# EAGLE design PCM1794_DAC_Test_V1_Power (EAGLE 6.4)

## Sheet 1 of 4: 3.3V Digital
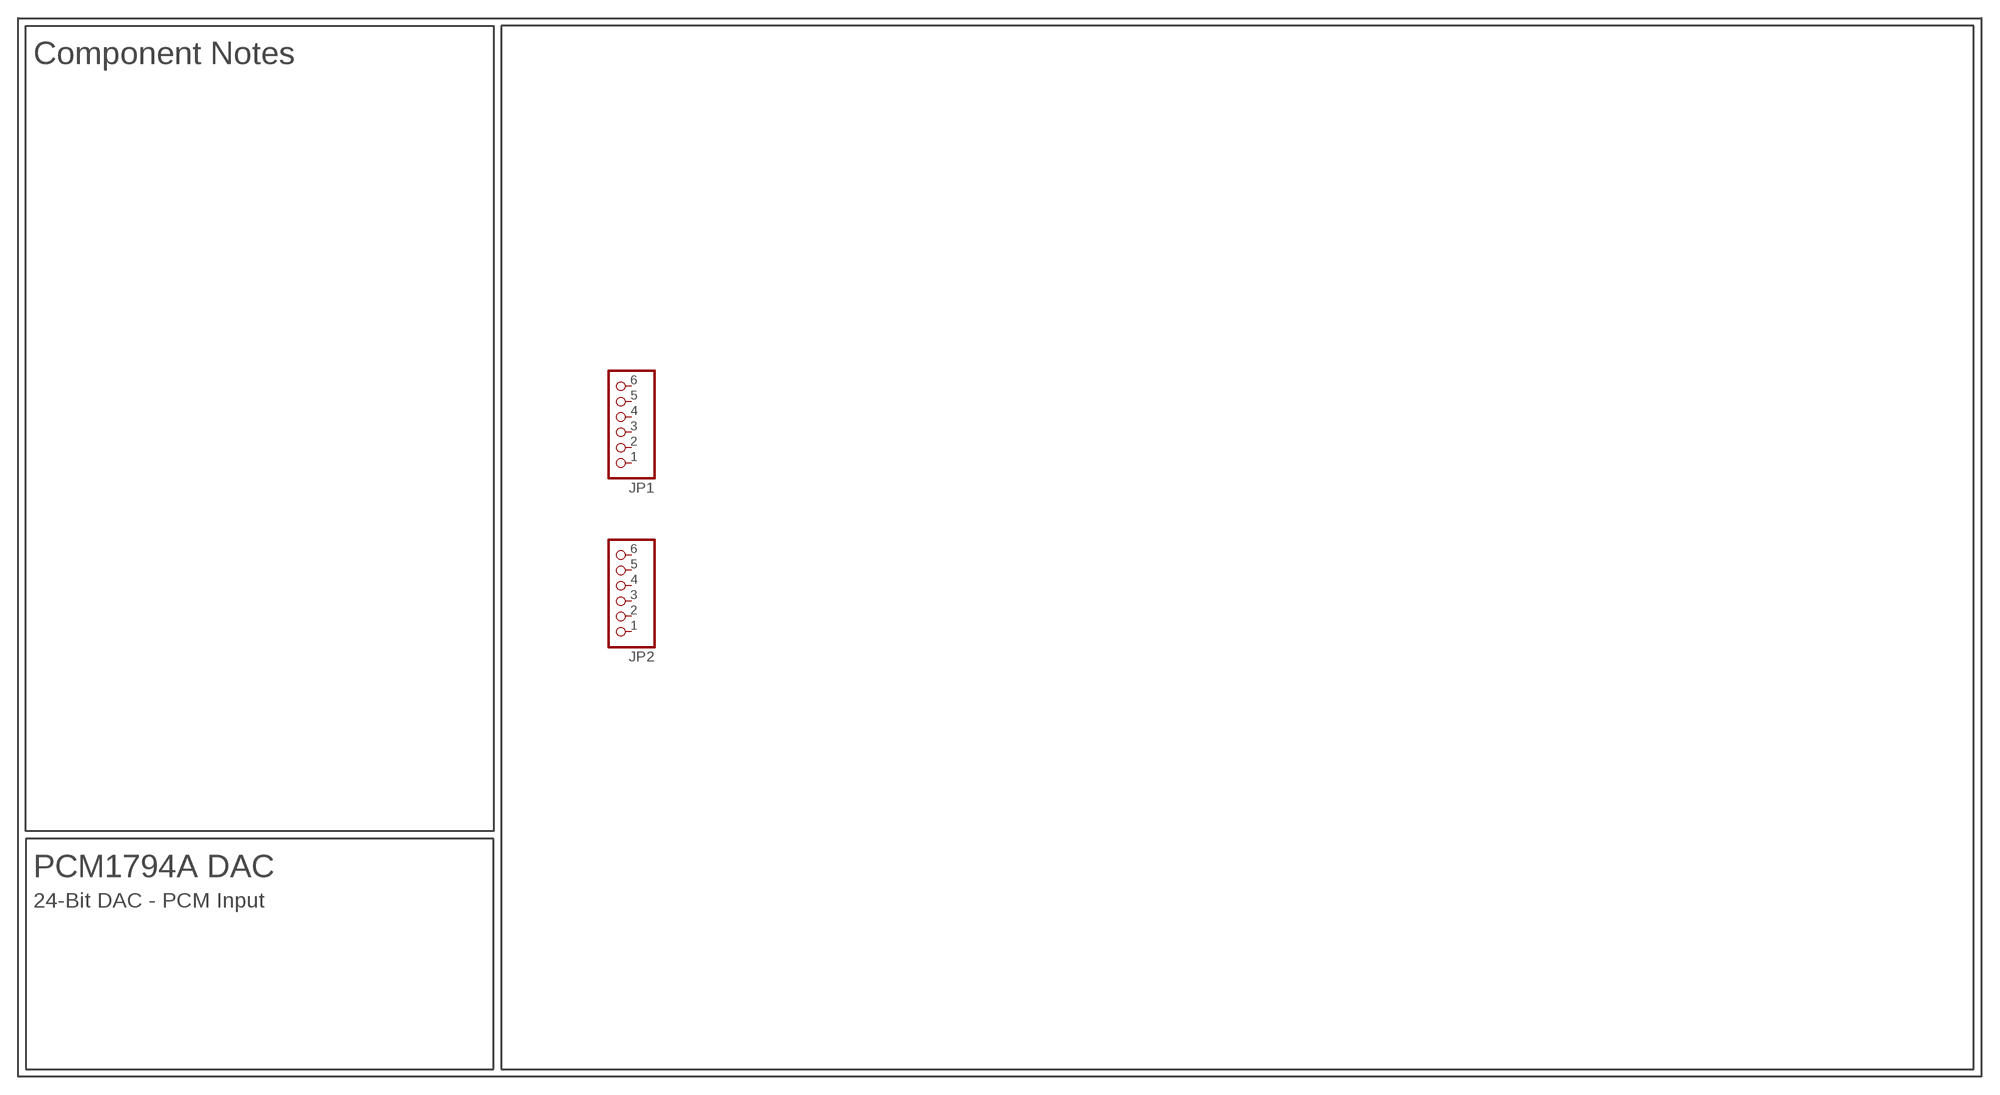
[diagram p0: schematic, sheet 1]

### Parts
JP1  PINHD-1X6  [1X06]
JP2  PINHD-1X6  [1X06]
Unconnected: JP1.1 JP1.2 JP1.3 JP1.4 JP1.5 JP1.6 JP2.1 JP2.2 JP2.3 JP2.4 JP2.5 JP2.6

### Notes on the sheet
- Component Notes
- PCM1794A DAC
- 24-Bit DAC - PCM Input

## Sheet 2 of 4: 5V Analog
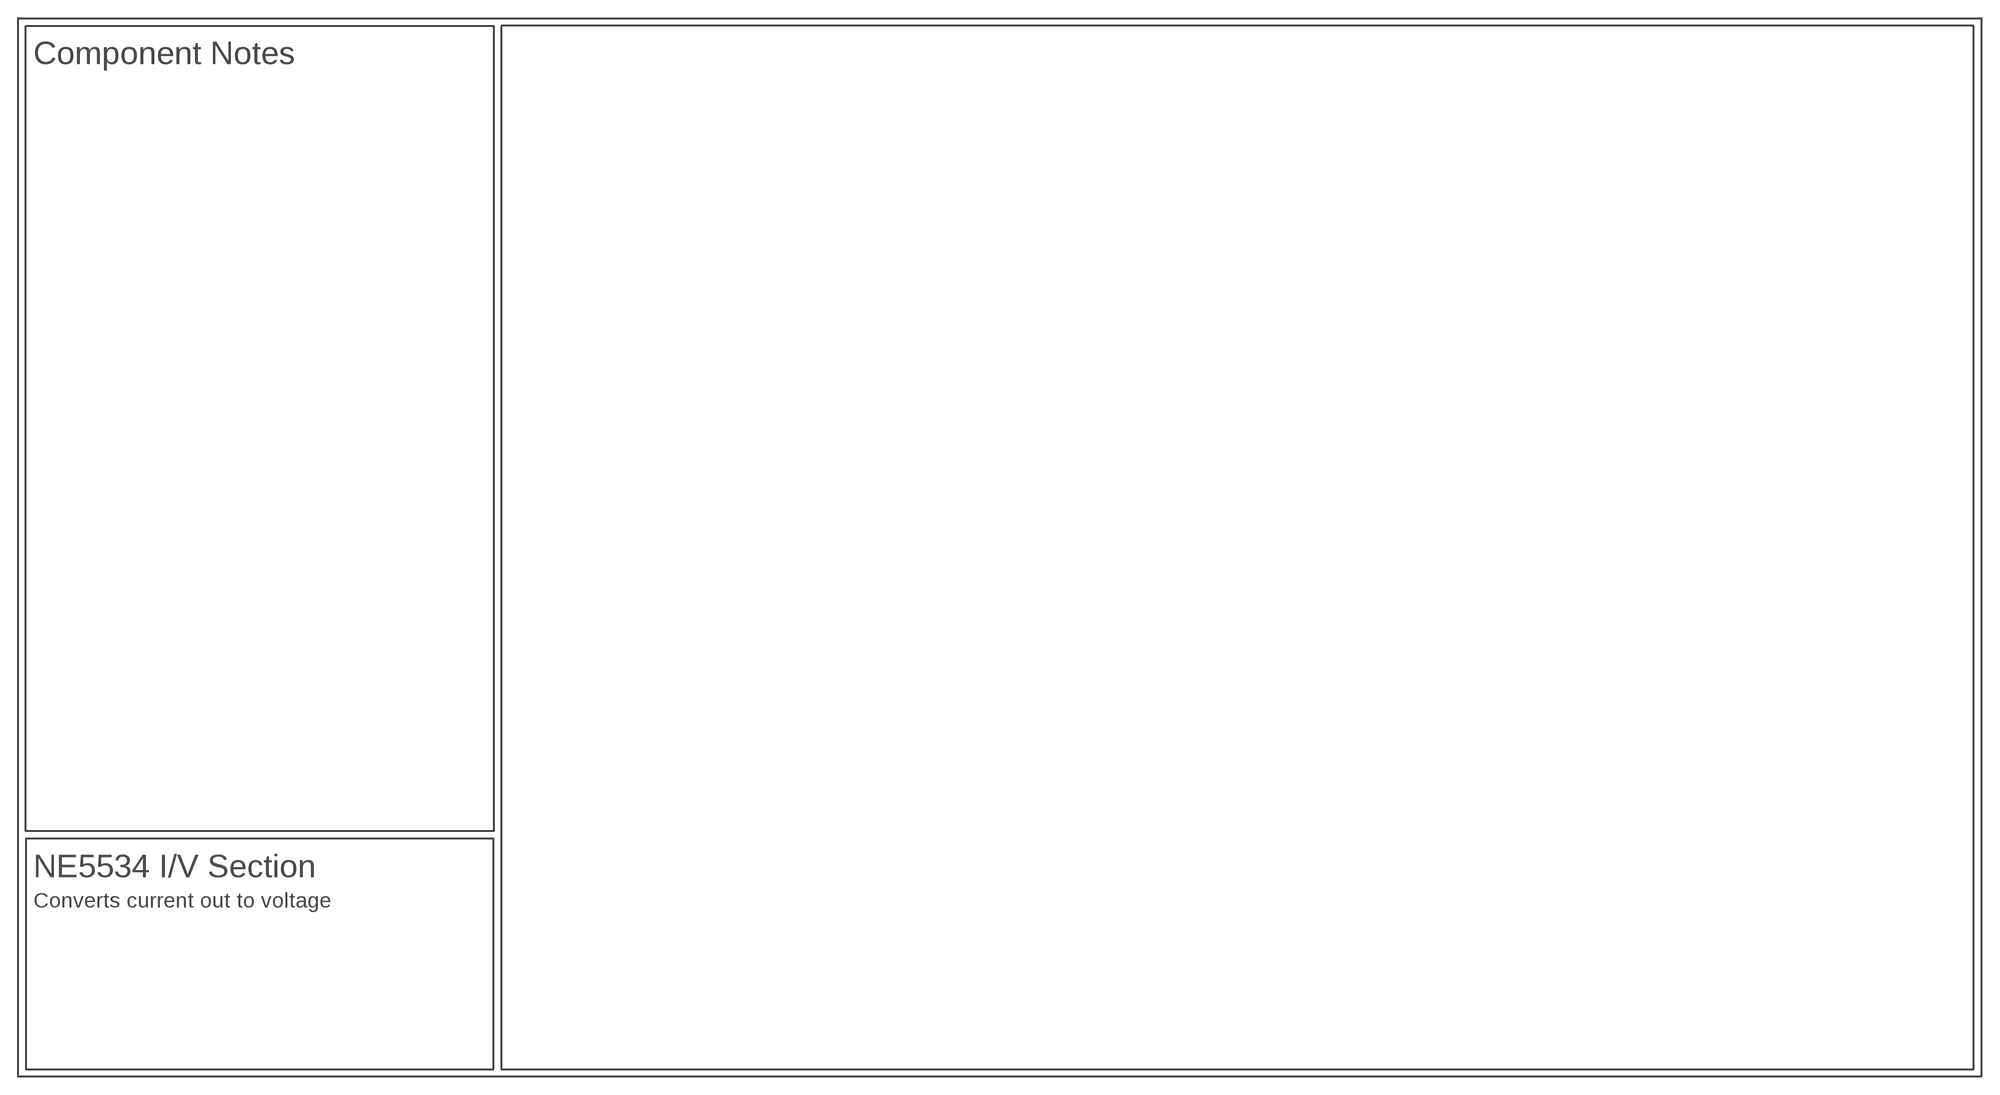
[diagram p1: schematic, sheet 2]

### Notes on the sheet
- Component Notes
- NE5534 I/V Section
- Converts current out to voltage

## Sheet 3 of 4: V+ Analog
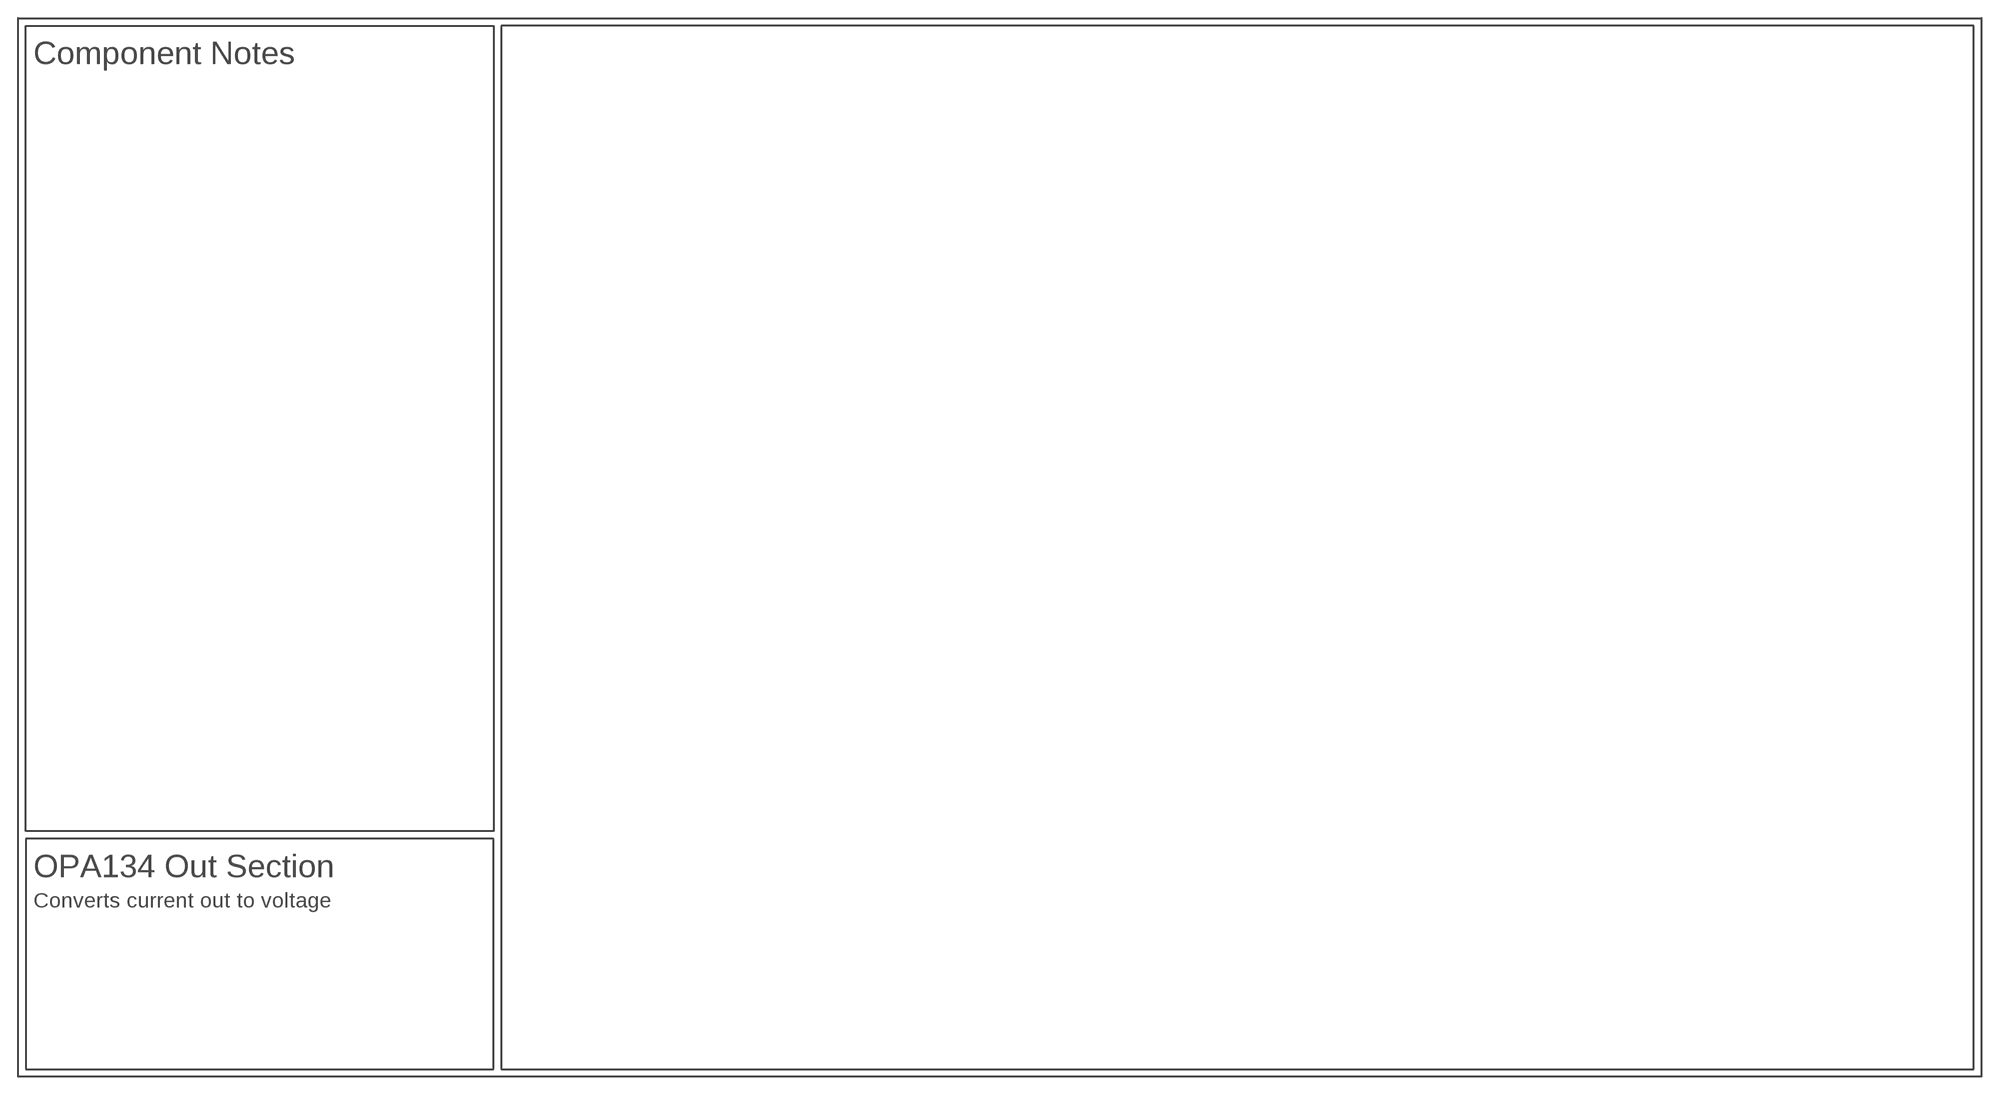
[diagram p2: schematic, sheet 3]

### Notes on the sheet
- Component Notes
- OPA134 Out Section
- Converts current out to voltage

## Sheet 4 of 4
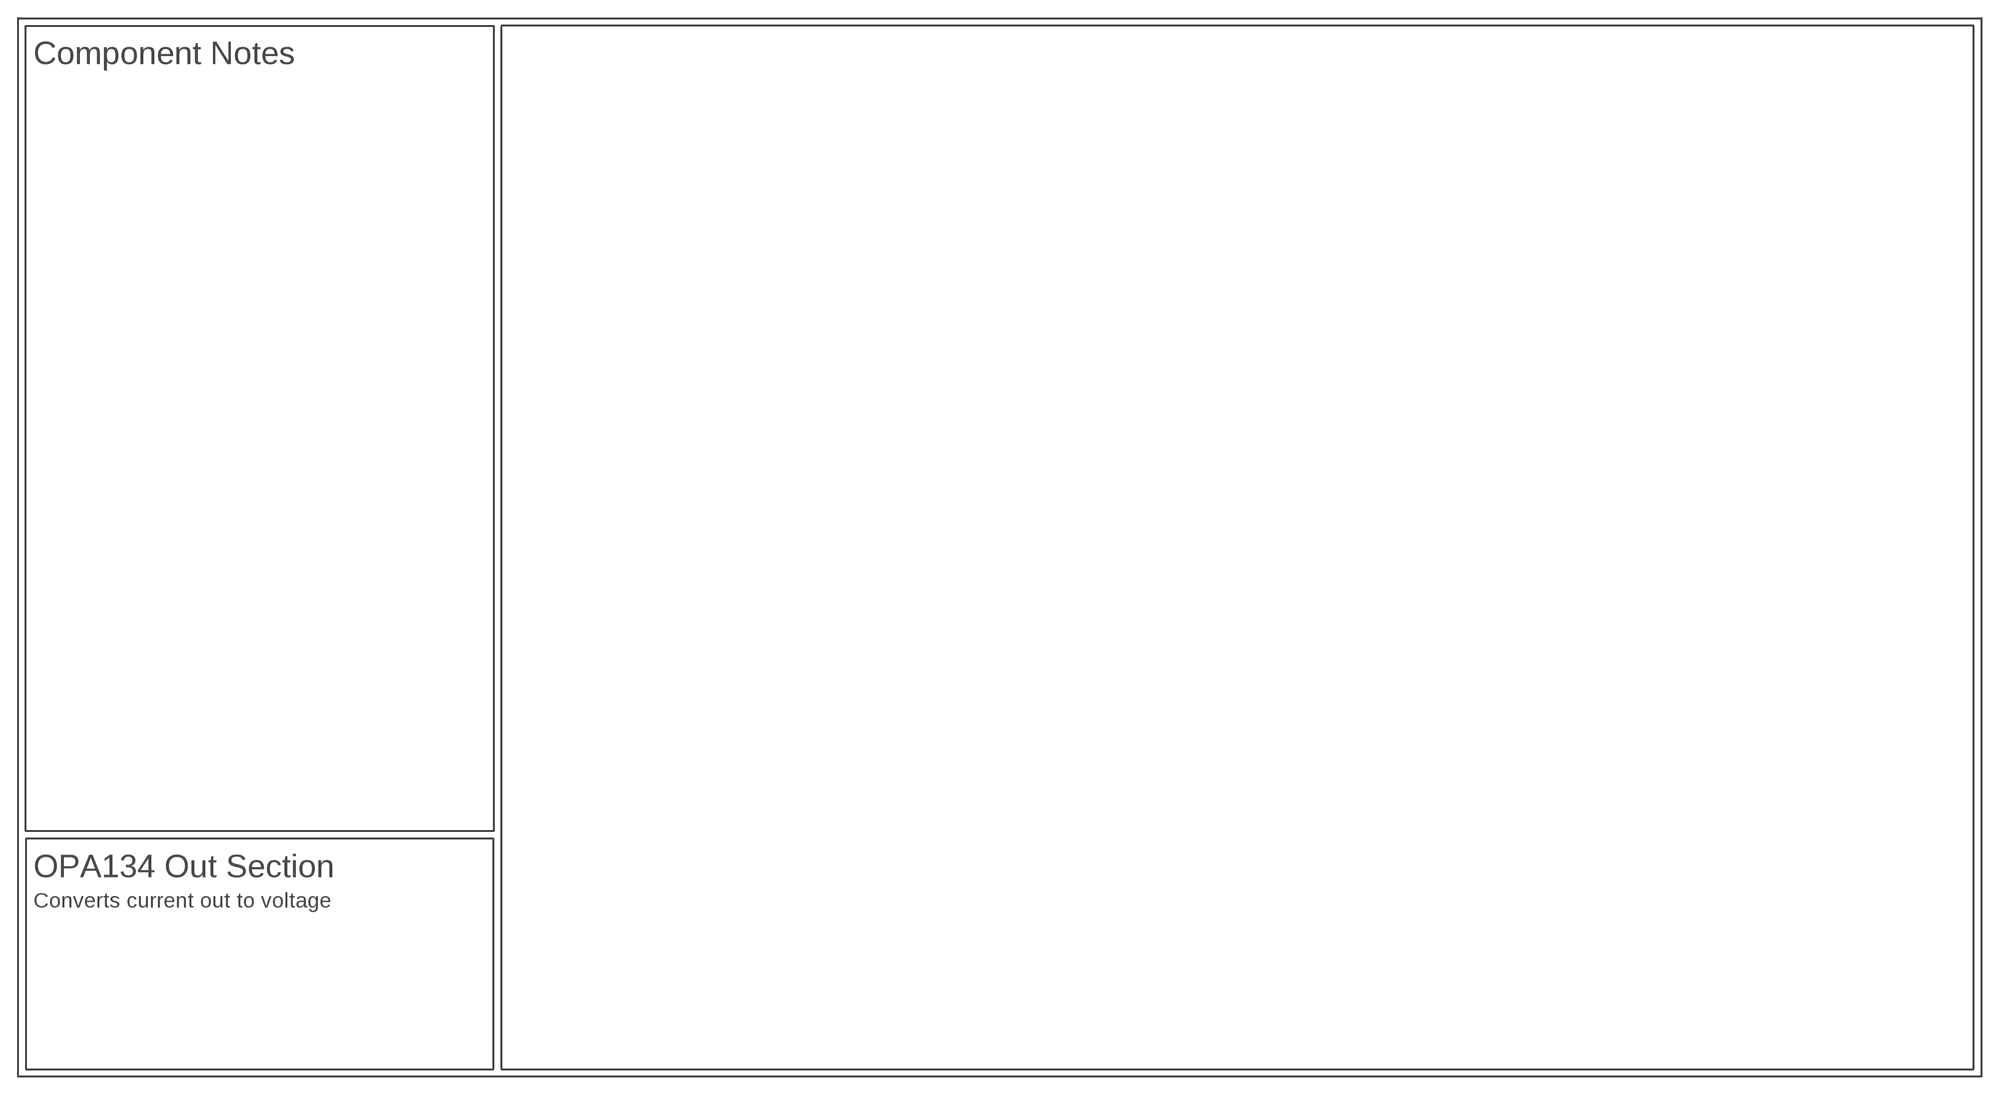
[diagram p3: schematic, sheet 4]

### Notes on the sheet
- Component Notes
- OPA134 Out Section
- Converts current out to voltage

## Library data of the parts
JP1 JP2 = pinhead_no_text:PINHD-1X6: PIN HEADER

## Board
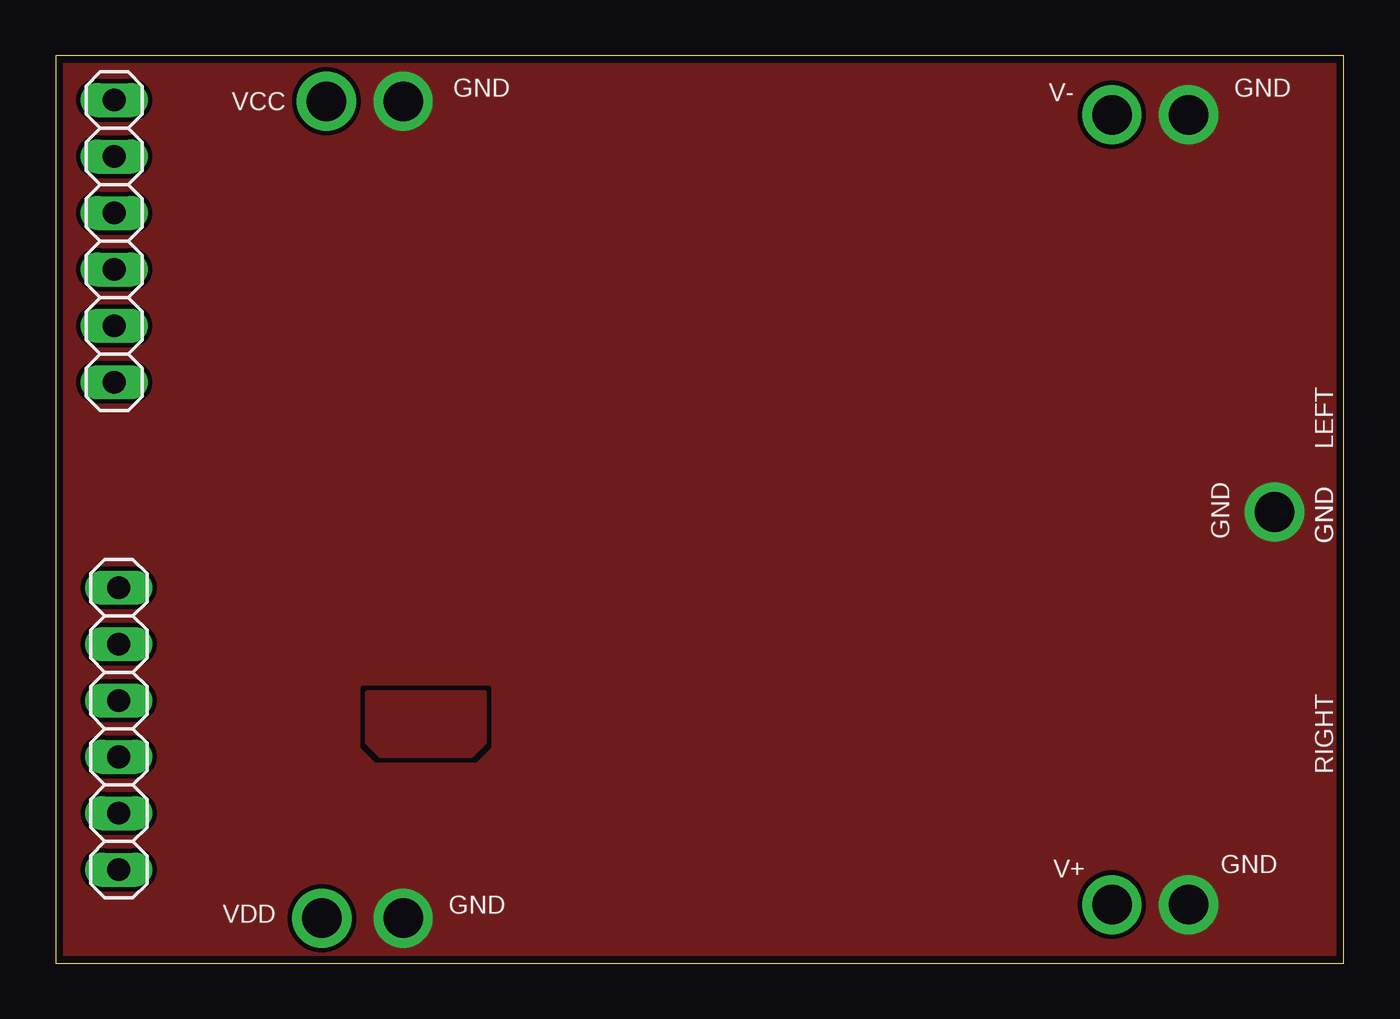
[diagram p4: board, top side]
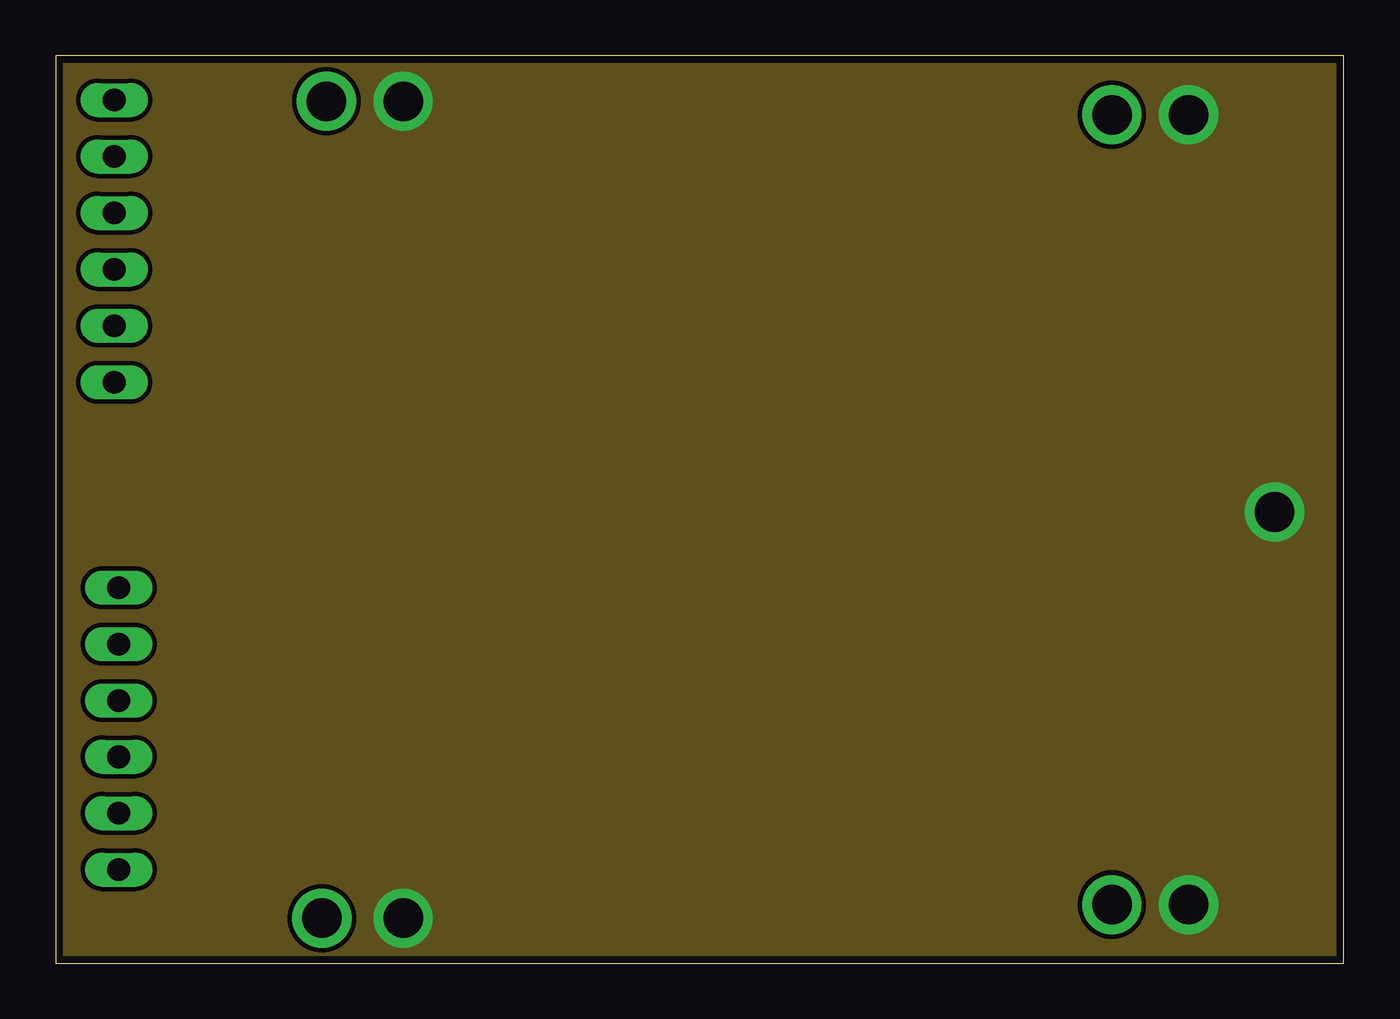
[diagram p5: board, inner layer Route2]
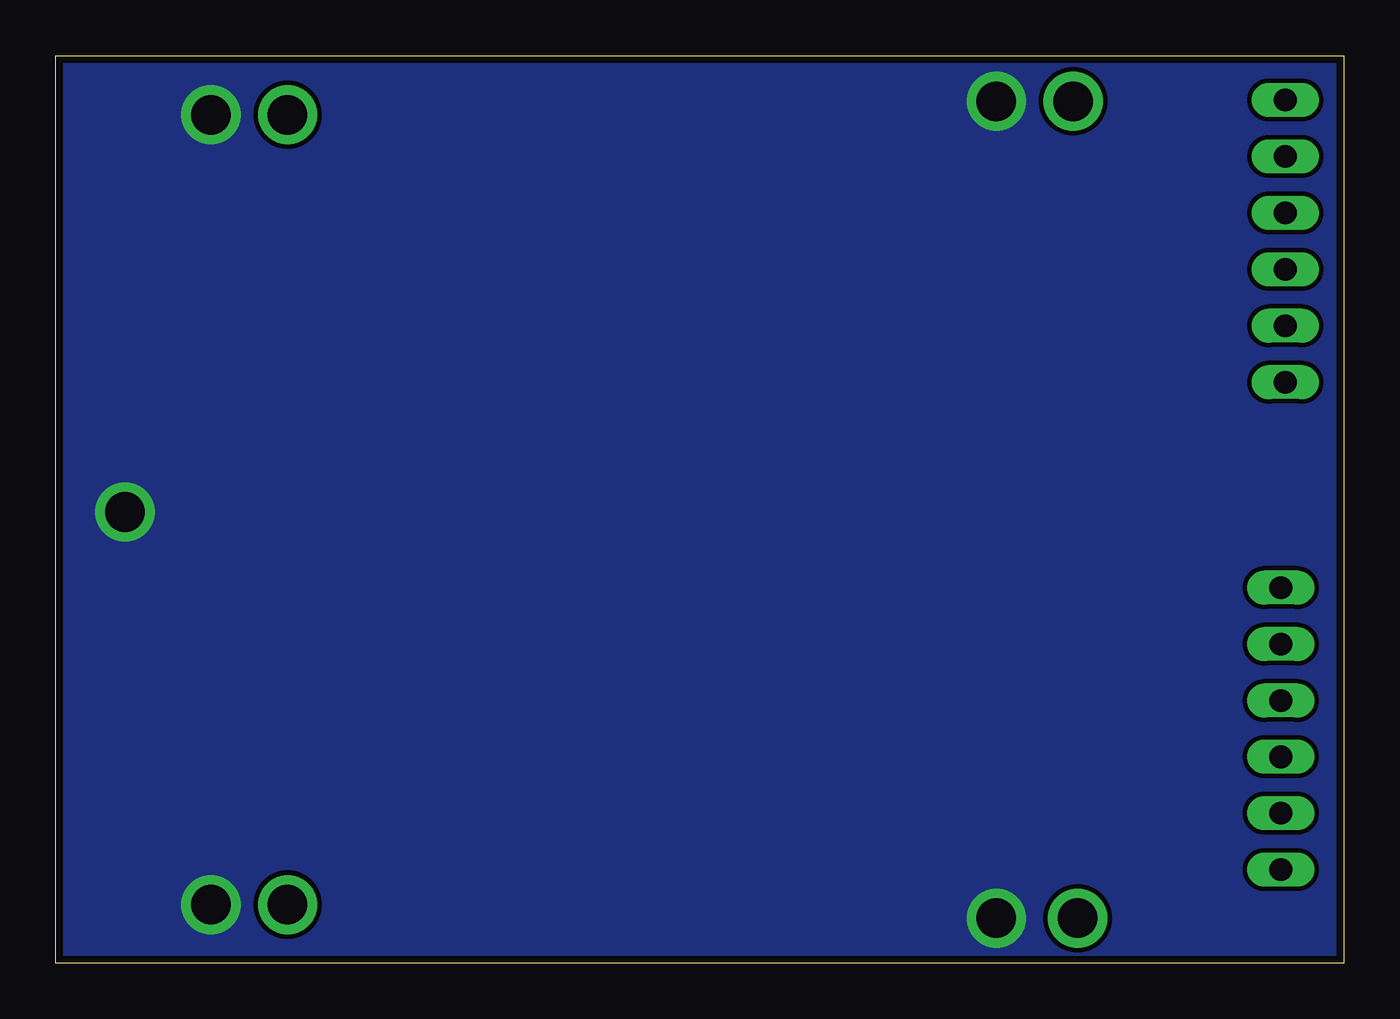
[diagram p6: board, bottom side, seen from below]

Size 57.99 x 40.87 mm. Coordinates in mm from the lower left corner, seen from the top.
Outline: 0,0 57.99,0 57.99,40.87 0,40.87 0,0
Copper layers (1*2*3*16): Top 0.035mm / dielectric 1.5mm / Route2 0.035mm / dielectric 0.15mm / Route3 0.035mm / dielectric 0.2mm / Bottom 0.035mm
Design rules "default *": minimum track width 5mil, minimum drill 10mil, track to track 8mil, track to pad 8mil, pad to pad 8mil, via to via 8mil, smd to smd 8mil, copper to edge 13mil, drill to drill 8mil, minimum pad ring 10mil, minimum via ring 8mil, stop-mask expansion 4mil, vias tented up to drill 0mil, thermal gap 10mil

### Footprints (pad centres in the part's own frame; a part is rotated, then mirrored left to right if it is on the bottom)
1X06 = drill 1.016 long: 1 -6.35,0; 2 -3.81,0; 3 -1.27,0; 4 1.27,0; 5 3.81,0; 6 6.35,0

### Placement (x,y rotation side)
JP1  2.84,10.57 270 top
JP2  2.64,32.51 270 top

### Tracks (layer width: path | path; a pad name or v marks a point on that pad's centre or on a via)
GND  (via drill 1.78)
  other vias: 54.86,20.32 15.65,38.81 15.65,2.03 51,2.64 51,38.2
  pour Bottom (rank 6, no thermals): 0.2,40.64 57.71,40.64 57.71,0.2 0.2,0.2
  pour Top (rank 6, no thermals): 0.2,40.64 57.71,40.64 57.71,0.2 0.2,0.2
  pour Route2 (rank 6, no thermals): 0.2,40.64 57.71,40.64 57.71,0.2 0.2,0.2
N$1  (via drill 1.78)
  other vias: 11.99,2.03
V+  (via drill 1.78)
  other vias: 47.55,2.64
V-  (via drill 1.78)
  other vias: 47.55,38.2
VCC  (via drill 1.78)
  other vias: 12.19,38.81
  pour Top (no thermals): 14.02,12.19 14.02,9.96 14.63,9.35 18.69,9.35 19.3,9.96 19.3,12.19

### Text on the board
tPlace: VCC | GND | V- | GND | LEFT | GND | GND | GND | RIGHT | V+ | GND | VDD | GND